# EasyEDA schematic Bumper.json
TITLE: Bumper; REV: 1.0; Date: 2023-11-20; Sheet: 1/1; Drawn By: Ryan Bazzell; Company: Cedarville University
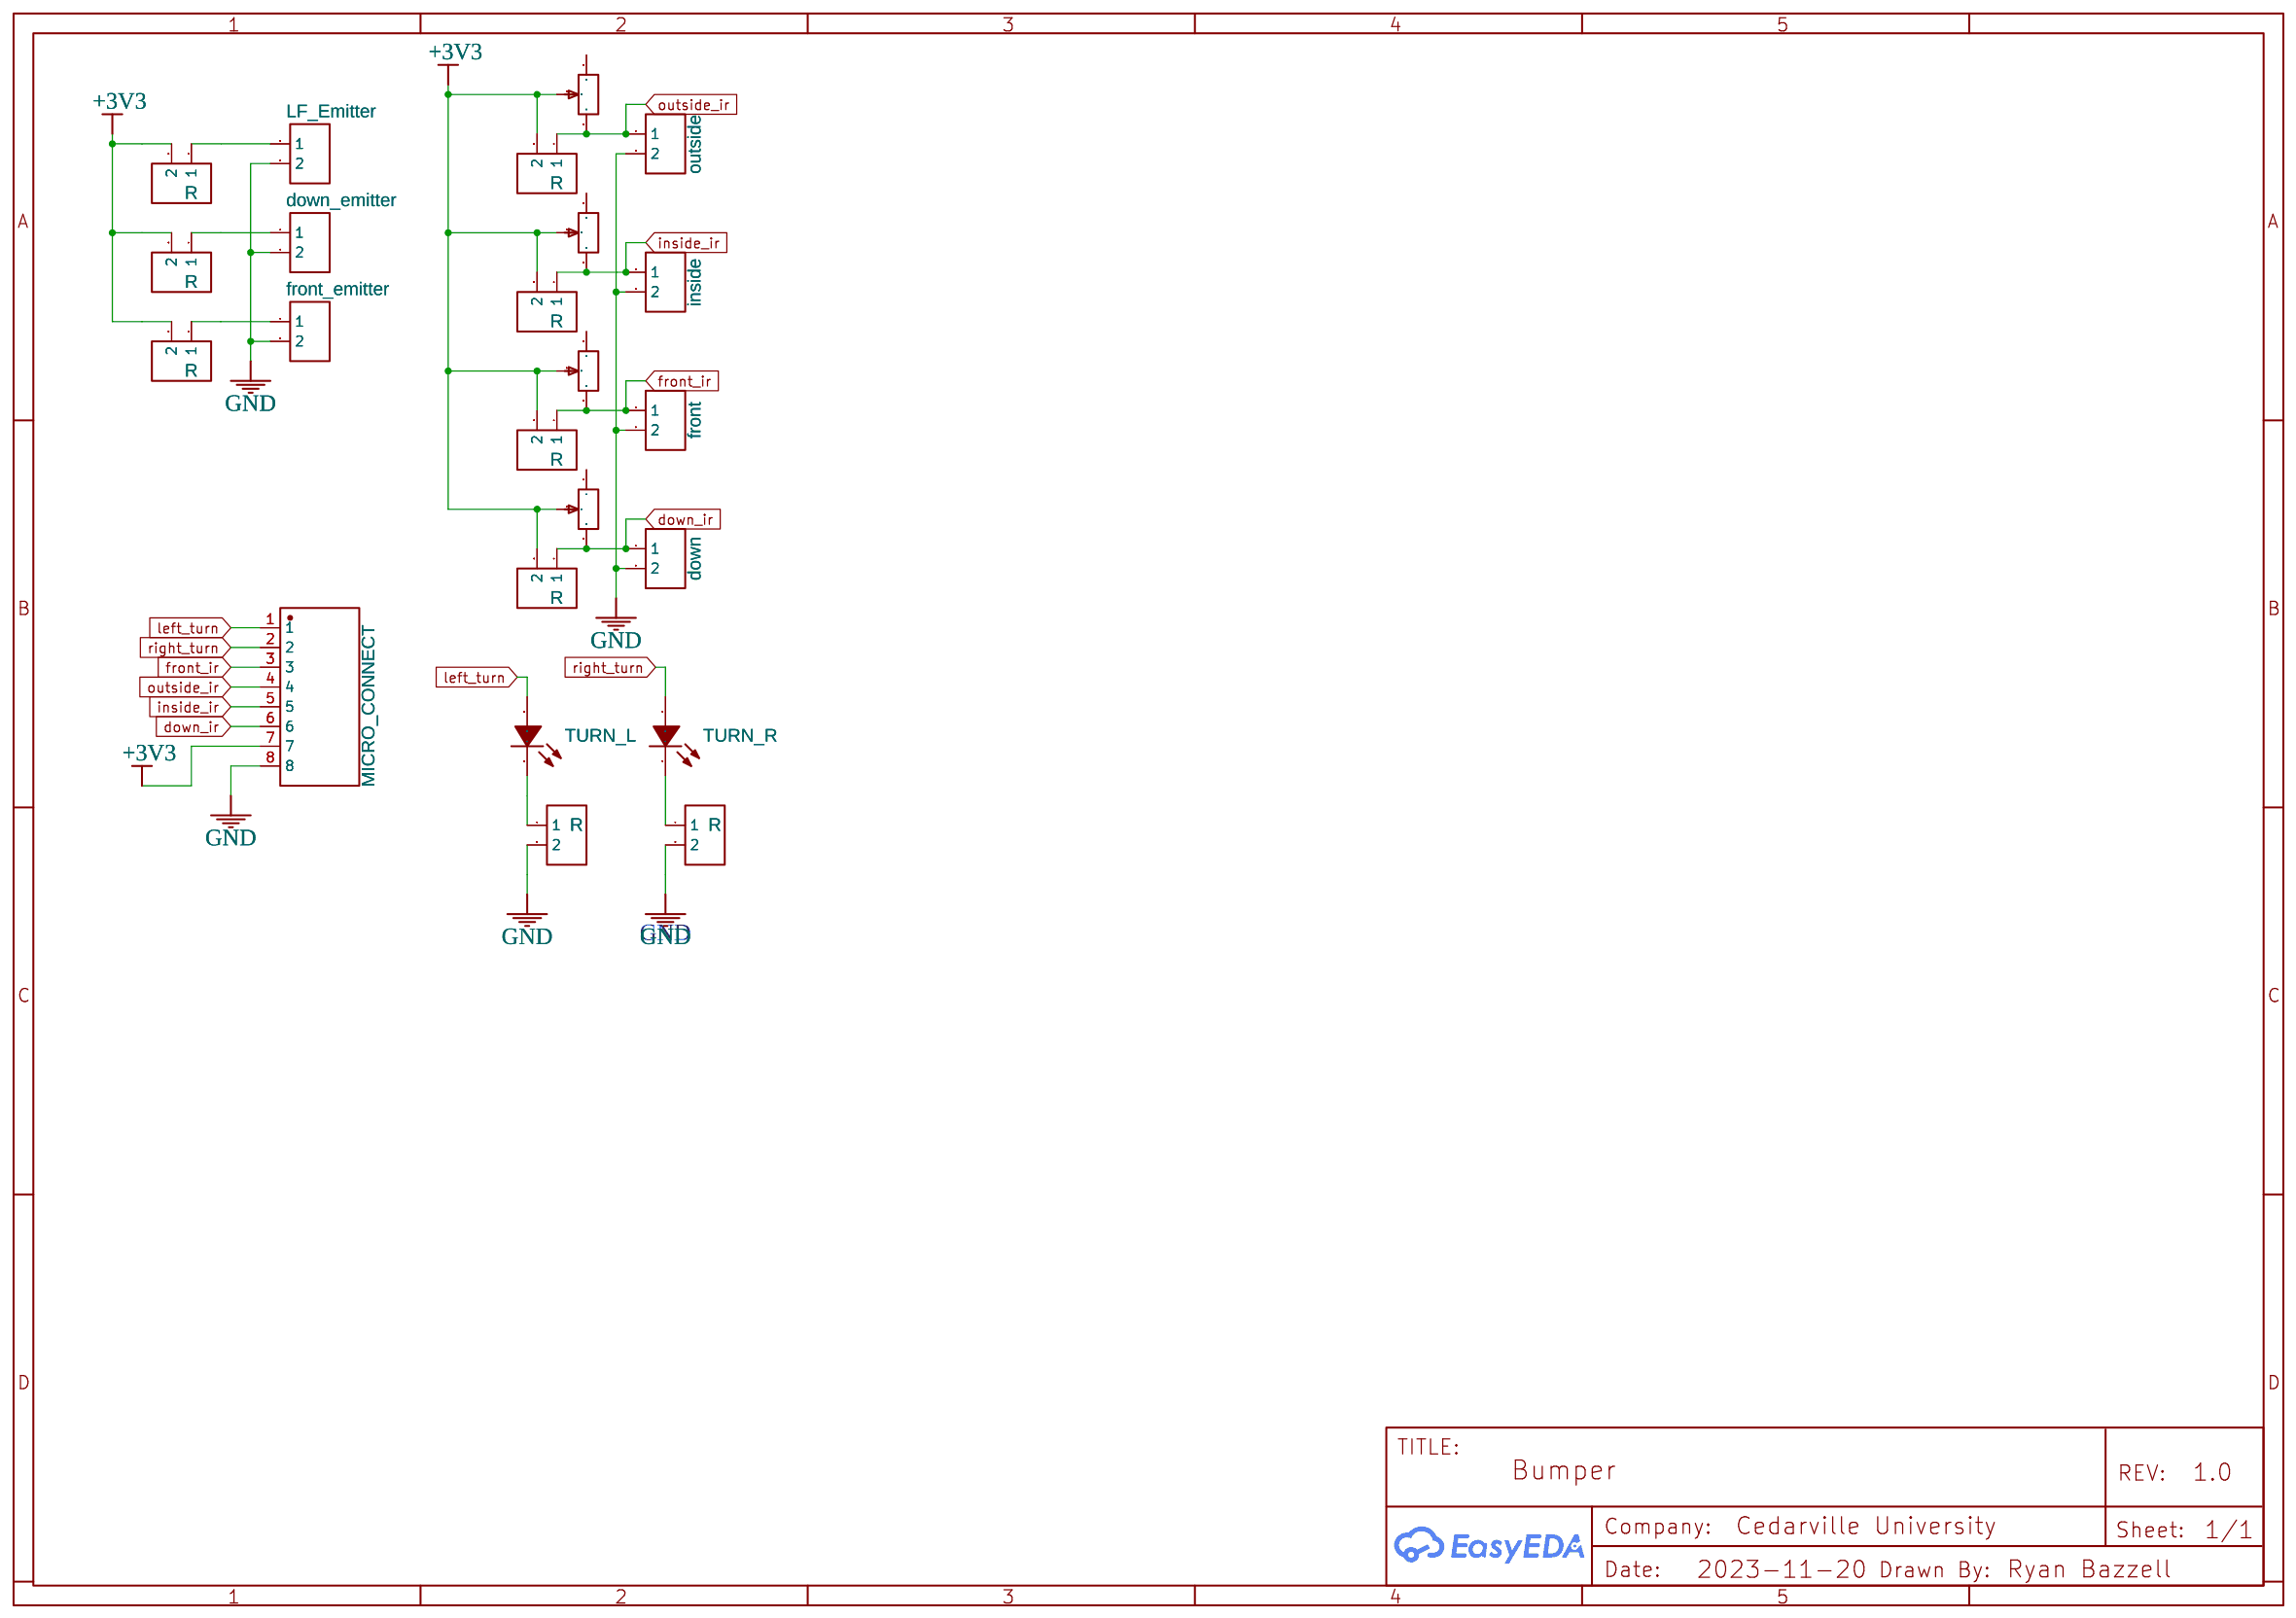
[diagram p0: schematic sheet]

## Parts
CN1  MICRO_CONNECT  [CONN-TH_B8B-XH-A-LF-SN]
DOWN  down  [HDR-F-2.54_1X2]
DOWN_EMITTER  down_emitter  [HDR-F-2.54_1X2]
FRONT  front  [HDR-F-2.54_1X2]
FRONT_EMITTER  front_emitter  [HDR-F-2.54_1X2]
INSIDE  inside  [HDR-F-2.54_1X2]
LF_EMITTER  LF_Emitter  [HDR-F-2.54_1X2]
OUTSIDE  outside  [HDR-F-2.54_1X2]
OUTSIDE1  R  [HDR-F-2.54_1X2]
OUTSIDE2  R  [HDR-F-2.54_1X2]
OUTSIDE3  R  [HDR-F-2.54_1X2]
OUTSIDE4  R  [HDR-F-2.54_1X2]
OUTSIDE5  R  [HDR-F-2.54_1X2]
OUTSIDE6  R  [HDR-F-2.54_1X2]
OUTSIDE7  R  [HDR-F-2.54_1X2]
OUTSIDE8  R  [HDR-F-2.54_1X2]
OUTSIDE9  R  [HDR-F-2.54_1X2]
R8  10kΩ  [RES-ADJ-TH_3296W]
R9  10kΩ  [RES-ADJ-TH_3296W]
R10  10kΩ  [RES-ADJ-TH_3296W]
R11  10kΩ  [RES-ADJ-TH_3296W]
TURN_L  204-10UYD/S530-A3-L  [LED-TH_BD3.0-P2.54-FD]
TURN_R  204-10UYD/S530-A3-L  [LED-TH_BD3.0-P2.54-FD]

## Library data of the parts
CN1 = B8B-XH-A (LF)(SN): Contributor: LCSC; Supplier: LCSC; Supplier Part: C157972; Manufacturer: JST; Manufacturer Part: B8B-XH-A(LF)(SN); JLCPCB Part Class: Extended Part; link: https://lcsc.com/eda_search?q=C157972&%26type=1&ref=editor
DOWN DOWN_EMITTER FRONT FRONT_EMITTER INSIDE LF_EMITTER OUTSIDE OUTSIDE1-OUTSIDE9 = HDR-F-2.54_1x2: Supplier Part: C49661; Supplier: LCSC; Contributor: LCEDA_Lib
R8-R11 = 3296W-1-103LF: Resistance(Ohms): 10K; Supplier: LCSC; Manufacturer: BOURNS; Supplier Part: C34846; JLCPCB Part Class: Extended Part
TURN_L TURN_R = 204-10UYD/S530-A3-L: Supplier: LCSC; Manufacturer: EVERLIGHT(亿光); Supplier Part: C85160; JLCPCB Part Class: Extended Part

## Nets
+3V3: CN1.7 OUTSIDE1.2 OUTSIDE2.2 OUTSIDE3.2 OUTSIDE4.2 OUTSIDE5.2 OUTSIDE6.2 OUTSIDE7.2 R8.2 R9.2 R10.2 R11.2
GND: CN1.8 DOWN.2 DOWN_EMITTER.2 FRONT.2 FRONT_EMITTER.2 INSIDE.2 LF_EMITTER.2 OUTSIDE.2 OUTSIDE8.2 OUTSIDE9.2
down_ir: CN1.6 DOWN.1 OUTSIDE4.1 R11.3
front_ir: CN1.3 FRONT.1 OUTSIDE3.1 R9.3
inside_ir: CN1.5 INSIDE.1 OUTSIDE2.1 R10.3
left_turn: CN1.1 TURN_L.1(A)
outside_ir: CN1.4 OUTSIDE.1 OUTSIDE1.1 R8.3
right_turn: CN1.2 TURN_R.1(A)
Net-(DOWN_EMITTER-1): DOWN_EMITTER.1 OUTSIDE6.1
Net-(FRONT_EMITTER-1): FRONT_EMITTER.1 OUTSIDE7.1
Net-(LF_EMITTER-1): LF_EMITTER.1 OUTSIDE5.1
Net-(OUTSIDE8-1): OUTSIDE8.1 TURN_L.2(K)
Net-(OUTSIDE9-1): OUTSIDE9.1 TURN_R.2(K)

Not connected (* = marked no-connect by the designer): R8 1; R9 1; R10 1; R11 1

## Notes on the sheet
- GND
